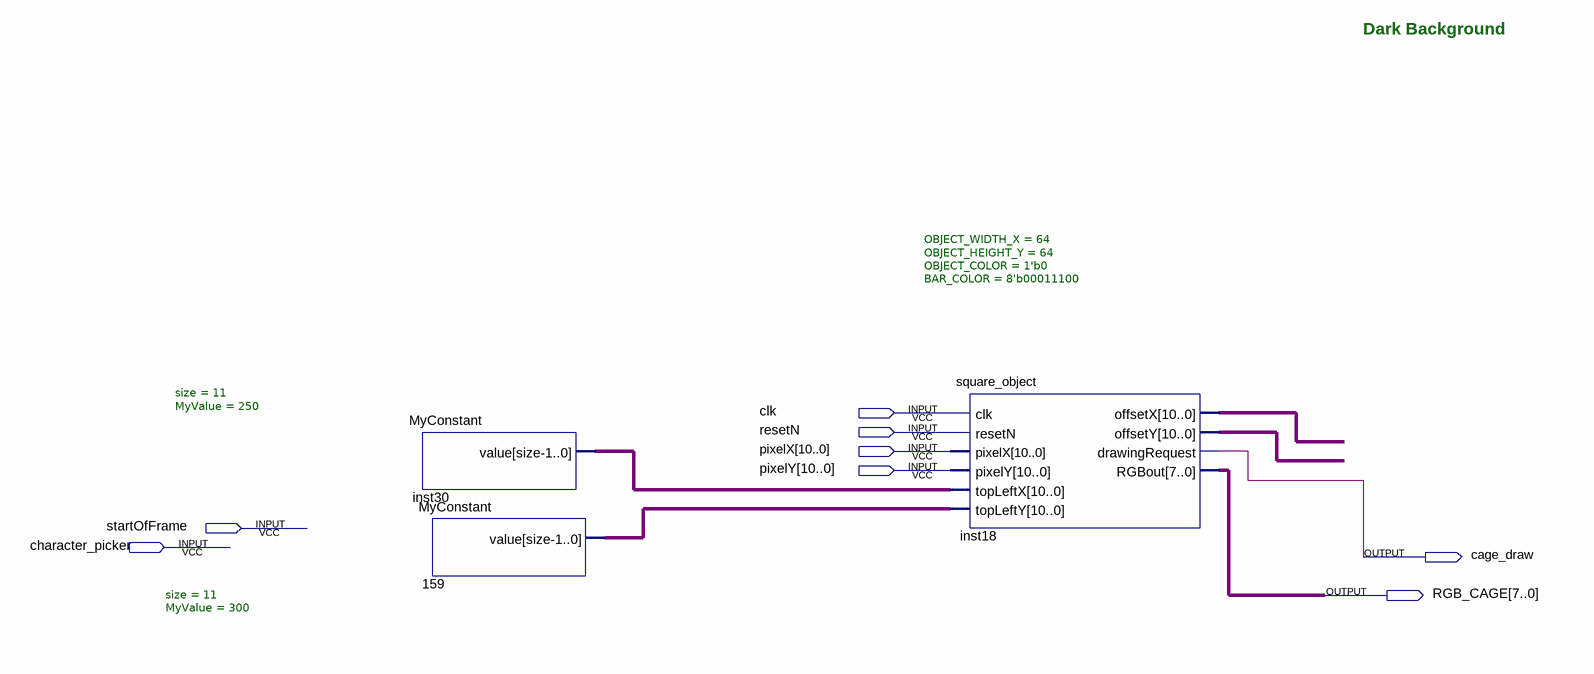
[diagram p0: schematic sheet]
// Quartus schematic page_1_top.bdf as structural Verilog: 3 symbols, 8 pins
module page_1_top (
  input  clk,
  input  resetN,
  input  [10:0] pixelX,
  input  [10:0] pixelY,
  input  startOfFrame,
  input  character_picker,
  output cage_draw,
  output [7:0] RGB_CAGE
);

  wire [10:0] inst18_offsetx, inst18_offsety, inst30_value, n159_value;

  MyConstant #(.size(11), .MyValue(250)) inst30 (.value(inst30_value));
  MyConstant #(.size(11), .MyValue(300)) u_159 (.value(n159_value));
  square_object #(.OBJECT_WIDTH_X(64), .OBJECT_HEIGHT_Y(64), .OBJECT_COLOR(1'b0), .BAR_COLOR(8'b00011100)) inst18 (
    .topLeftX(inst30_value), .topLeftY(n159_value), .offsetX(inst18_offsetx), .offsetY(inst18_offsety),
    .drawingRequest(cage_draw), .RGBout(RGB_CAGE));  // open: clk, resetN, pixelX, pixelY

  // Notes on the sheet:
  //   Dark Background
endmodule
